# Altium schematic sheet VBATTPrimary.SchDoc
size A; SheetNumber: 15; SheetTotal: 18
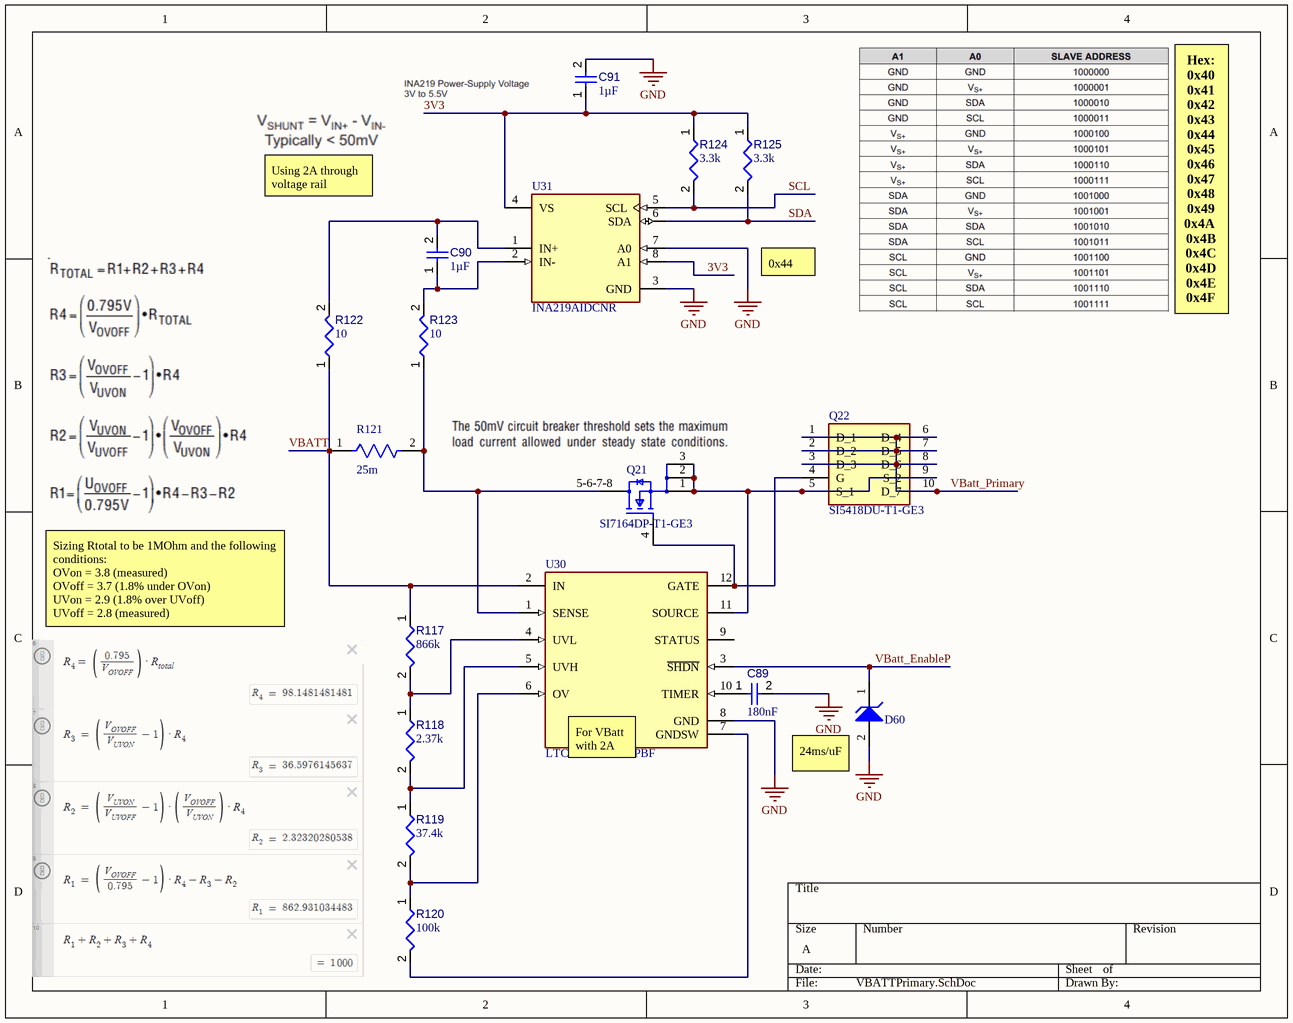
[diagram p0: VBATTPrimary.SchDoc]

## Parts
C89  value 180nF  [FP-C0805C-DN-IPC_A]  (hidden comment: C0805C184K5RACTU)
C90  value 1µF  [CAPC1608X90X40LL10T20]  (hidden comment: Capacitor 1 uF +/- 10% 25 V 0603)
C91  value 1µF  [CAPC1608X90X35ML15T15]  (hidden comment: Capacitor 1uF +/- 10% 16V 0603)
D60  MM3Z3V6T1G  [ONSC-SOD-323-2-477-02_V]  (value not drawn)
Q21  SI7164DP-T1-GE3  [Vishay_S17-0173-SINGLE_MFG]
Q22  SI5418DU-T1-GE3  [SI5418DU-T1-GE3-Footprint-1]
R117  value 866k  [RESC0603X26X15NL03T05]  (hidden comment: MC0201L6F8663SE)
R118  value 2.37k  [RESC0402(1005)_L]  (hidden comment: 2D37KR2F)
R119  value 37.4k  [FP-CR0603-IPC_A]  (hidden comment: CR0603-FX-3742ELF)
R120  value 100k  [RESC1005X40X25ML05T05]  (hidden comment: Resistor 100k +/-1% 0402 100 mW)
R121  Resistance: 25m  [FP-CSR1206-IPC_C]  (hidden comment: CSR1206FK25L0)
R122  value 10  [RESC0402(1005)_L]  (hidden comment: Resistor 10R  +/-1 % 0402 63 mW)
R123  value 10  [RESC0402(1005)_L]  (hidden comment: Resistor 10R  +/-1 % 0402 63 mW)
R124  value 3.3k  [FP-CRCW1210-e3-IPC_C]  (hidden comment: CRCW12103K30JNEA)
R125  value 3.3k  [FP-CRCW1210-e3-IPC_C]  (hidden comment: CRCW12103K30JNEA)
U30  LTC4231HMS-1#PBF  [FP-MS-12-05-08-1668-MFG]
U31  INA219AIDCNR  [FP-DCN0008A-IPC_A]

## Nets
GND: C89.2 C91.2 D60.2(A) U30.8(GND) U31.3(GND) U31.7(A0)
3V3: C91.1 R124.1 R125.1 U31.4(VS) U31.8(A1)
SCL: R124.2 U31.5(SCL)
SDA: R125.2 U31.6(SDA)
VBATT: R117.1 R121.1 R122.1 U30.2(IN)
VBatt_EnableP: D60.1(K) U30.3(~{SHDN})
VBatt_Primary: Q22.1(D_1) Q22.2(D_2) Q22.3(D_3) Q22.6(D_4) Q22.7(D_5) Q22.8(D_6) Q22.10(D_7)
NetC89_1: C89.1 U30.10(TIMER)
NetC90_1: C90.1 R123.2 U31.2(IN-)
NetC90_2: C90.2 R122.2 U31.1(IN+)
NetQ21_1: Q21.1(S) Q21.2(S) Q21.3(S) Q22.5(S_1) Q22.9(S_2) U30.11(SOURCE)
NetQ21_4: Q21.4(G) Q22.4(G) U30.12(GATE)
NetQ21_5-6-7-8: Q21.5-6-7-8(D) R121.2 R123.1 U30.1(SENSE)
NetR117_2: R117.2 R118.1 U30.4(UVL)
NetR118_2: R118.2 R119.1 U30.5(UVH)
NetR119_2: R119.2 R120.1 U30.6(OV)
NetR120_2: R120.2 U30.7(GNDSW)

Not connected (* = marked no-connect by the designer): U30 9(STATUS)

## Notes on the sheet
- Using 2A through voltage rail
- 0x44
- Hex:
  0x40
  0x41
  0x42
  0x43
  0x44
  0x45
  0x46
  0x47
  0x48
  0x49
  0x4A
  0x4B
  0x4C
  0x4D
  0x4E
  0x4F
- Sizing Rtotal to be 1MOhm and the following conditions:
  OVon = 3.8 (measured)
  OVoff = 3.7 (1.8% under OVon)
  UVon = 2.9 (1.8% over UVoff)
  UVoff = 2.8 (measured)
- (near U30) For VBatt
  with 2A
- (near D60) 24ms/uF

## Library data of the parts
C89 = CMP-001-00086-1: Ceramic Capacitor, Multilayer, Ceramic, 50V, 10% +Tol, 10% -Tol, X7R, 15% TC, 0.18uF, Surface Mount, 0805; Capacitor Type: Ceramic; Mounting Technology: Surface Mount; Pins: 2; Min Operating Temperature: -55°C; Case/Package: 0805; Max Operating Temperature: 125°C; RoHS Compliant: Yes
C90 = CMP-001-00005-6: Chip Capacitor, 1 uF, +/- 10%, 25 V, 0603 (1608 Metric); Capacitor Type: Ceramic; Voltage Rating: 25V; Pins: 2; Mounting Technology: SM; RoHS Compliant: True; Max Operating Temperature: 125°C; Case/Package: 0603; Min Operating Temperature: -55°C; Tolerance: 10%
C91 = CMP-001-00004-6: Chip Capacitor, 1 uF, +/- 10%, 16 V, 0603 (1608 Metric); Capacitor Type: Ceramic; Mounting Technology: SM; RoHS Compliant: True; Min Operating Temperature: -55°C; Case/Package: 0603; Pins: 2; Voltage Rating: 16V; Max Operating Temperature: 125°C; Tolerance: 10%
D60 = CMP-1060-00650-1: Zener Voltage Regulator, 300 mW, 2-Pin SOD-323, Pb-Free, Tape and Reel; Manufacturer: On Semiconductor; VZ Typ (V): 3.6; P Max (W): 0.3; RoHS: Pb-Free; ComponentLink1URL: http://www.onsemi.com/; PackageVersion: Rev. H, 03/2007; PartNumber: MM3Z3V6T1G; ComponentLink2Description: Datasheet; ComponentLink2URL: http://www.onsemi.cn/pub_link/Collateral/MM3Z2V4T1-D.PDF; DatasheetVersion: Rev. 9; PackageReference: SOD-323-2-477-02; ComponentLink3URL: http://www.onsemi.com/pub_link/Collateral/477-02.PDF.1; Packing: Tape and Reel; Mounting Technology: Surface Mount; ComponentLink3Description: Package Specification; PackageDescription: 2-Pin SOD, Body 1.7 x 1.25 mm; ComponentLink1Description: Manufacturer URL
Q21 = CMP-013-00040-1: Power Field-Effect Transistor, 23.5A I(D), 60V, 0.00625ohm, 1-Element, N-Channel, Silicon, Metal-oxide Semiconductor FET; Pins: 5; RoHS Compliant: Yes; Max Operating Temperature: 150°C
Q22 = CMP-013-00041-1: Power Field-Effect Transistor, 11.6A I(D), 30V, 0.0145ohm, 1-Element, N-Channel, Silicon, Metal-oxide Semiconductor FET; Max Operating Temperature: 150°C; RoHS Compliant: Yes; Pins: 3
R117 = CMP-009-00205-1: Fixed Resistor, Metal Glaze/thick Film, 0.05W, 866000ohm, 25V, 1% +/-Tol, -200,200ppm/Cel, 0201; Power: 50mW; Max Operating Temperature: 125°C; Tolerance: 1%; Case/Package: 0201; Pins: 2; RoHS Compliant: Yes; Min Operating Temperature: -55°C
R118 = CMP-009-00089-2: 2K37 0.063W 1% 0402 (1005 Metric)  SMD; Power: 63mW; Pins: 2; Tolerance: 1%; Case/Package: 0402; Mounting Technology: SMT
R119 = CMP-009-00206-1: Fixed Resistor, Metal Glaze/thick Film, 0.1W, 37400ohm, 75V, 1% +/-Tol, 100ppm/Cel, Surface Mount, 0603; Power: 100mW; Min Operating Temperature: -55°C; Mounting Technology: Surface Mount; Case/Package: 0603; Max Operating Temperature: 155°C; RoHS Compliant: Yes; Pins: 2; Tolerance: 1%
R120 = CMP-009-00022-5: Chip Resistor, 100 KOhm, +/- 1%, 0.1 W, -55 to 155 degC, 0402 (1005 Metric); Power: 100mW; Voltage Rating: 50V; Mounting Technology: SM; Pins: 2; Min Operating Temperature: -55°C; Tolerance: 1%; RoHS Compliant: True; Case/Package: 0402; Max Operating Temperature: 155°C
R121 = CMP-26527-000133-1: General Purpose Thick Film Chip Resistor, 1206, 25mΩ, 1%, 0.5W; Max Power Dissipation: 500mW; Temperature Coefficient: 100ppm/°C; Lead Free: Lead Free; Military Standard: Not; Case Code (Imperial): 1206; Max Operating Temperature: 155°C; Case Code (Metric): 3216; Height: 0.026inch; Packaging: Tape and Reel; Case/Package: 1206; Series: CSR; Number of Terminations: 2; RoHS Compliant: Yes; Mount: Surface Mount; Depth: 1.55mm; Contact Plating: Tin; Length: 0.12inch; Radiation Hardening: No; Width: 0.061inch; Size Code: 1206; Power Rating: 500mW; Min Operating Temperature: -55°C; Tolerance: 1%; Resistor Type: Thick Film; Construction: Rectangular
R122 R123 = CMP-009-00152-3: Chip Resistor, 10 Ohms, +/-1 %, 63 mW, -55 to 155 degC, 0402; Tolerance: 1%; Power: 63mW; Pins: 2; Max Operating Temperature: 155°C; Min Operating Temperature: -55°C; Case/Package: 0402
R124 R125 = CMP-009-00192-1: Fixed Resistor, Metal Glaze/thick Film, 0.5W, 3300ohm, 200V, 5% +/-Tol, 200ppm/Cel, Surface Mount, 1210; Power: 500mW; RoHS Compliant: Yes; Max Operating Temperature: 155°C; Case/Package: 1210; Min Operating Temperature: -55°C; Mounting Technology: Surface Mount; Tolerance: 5%; Pins: 2
U30 = CMP-09134-000012-1: IC HOT SWAP CTRLR GP 12MSOP; Operating Supply Current: 4uA; Number of Channels: 1; Min Supply Voltage: 2.7V; Max Supply Voltage: 36V; Number of Pins: 12; Features: Latched Fault; Max Operating Temperature: 125°C; Mount: Surface Mount; Packaging: Rail/Tube; Min Operating Temperature: -40°C; REACH SVHC: No SVHC; Case/Package: MSOP; RoHS Compliant: Yes
U31 = CMP-010-00025-1: Power Supply Support Circuit, Fixed, 2 Channel, 2V, PDSO8; Nominal Supply Voltage: 3.3V; Max Supply Voltage: 5.5V; Min Supply Voltage: 3V; Case/Package: LSSOP; Max Operating Temperature: 125°C; Min Operating Temperature: -40°C; Pins: 8; RoHS Compliant: Yes